# Altium schematic sheet Clock_circuit.SchDoc: FMC_ADC
size 420 x 297 mm; Author: G.Kasprowicz; CompanyName: WUT ISE; DrawnBy: G.Kasprowicz; Organization: WUT ISE; Address1: PW ISE; Address2: Nowowiejska 15/19 00-665 Warsaw; Address3: gkasprow@gmail.com; DocumentNumber: 6; Revision: 2; SheetNumber: 6; SheetTotal: 12; ModifiedBy: -; CheckedDate: -; Title2: Clock distribution; DivGrp: WUT ISE; Designer: G.Kasprowicz; ModifiedDate: -; ProjectName: Sensor Box
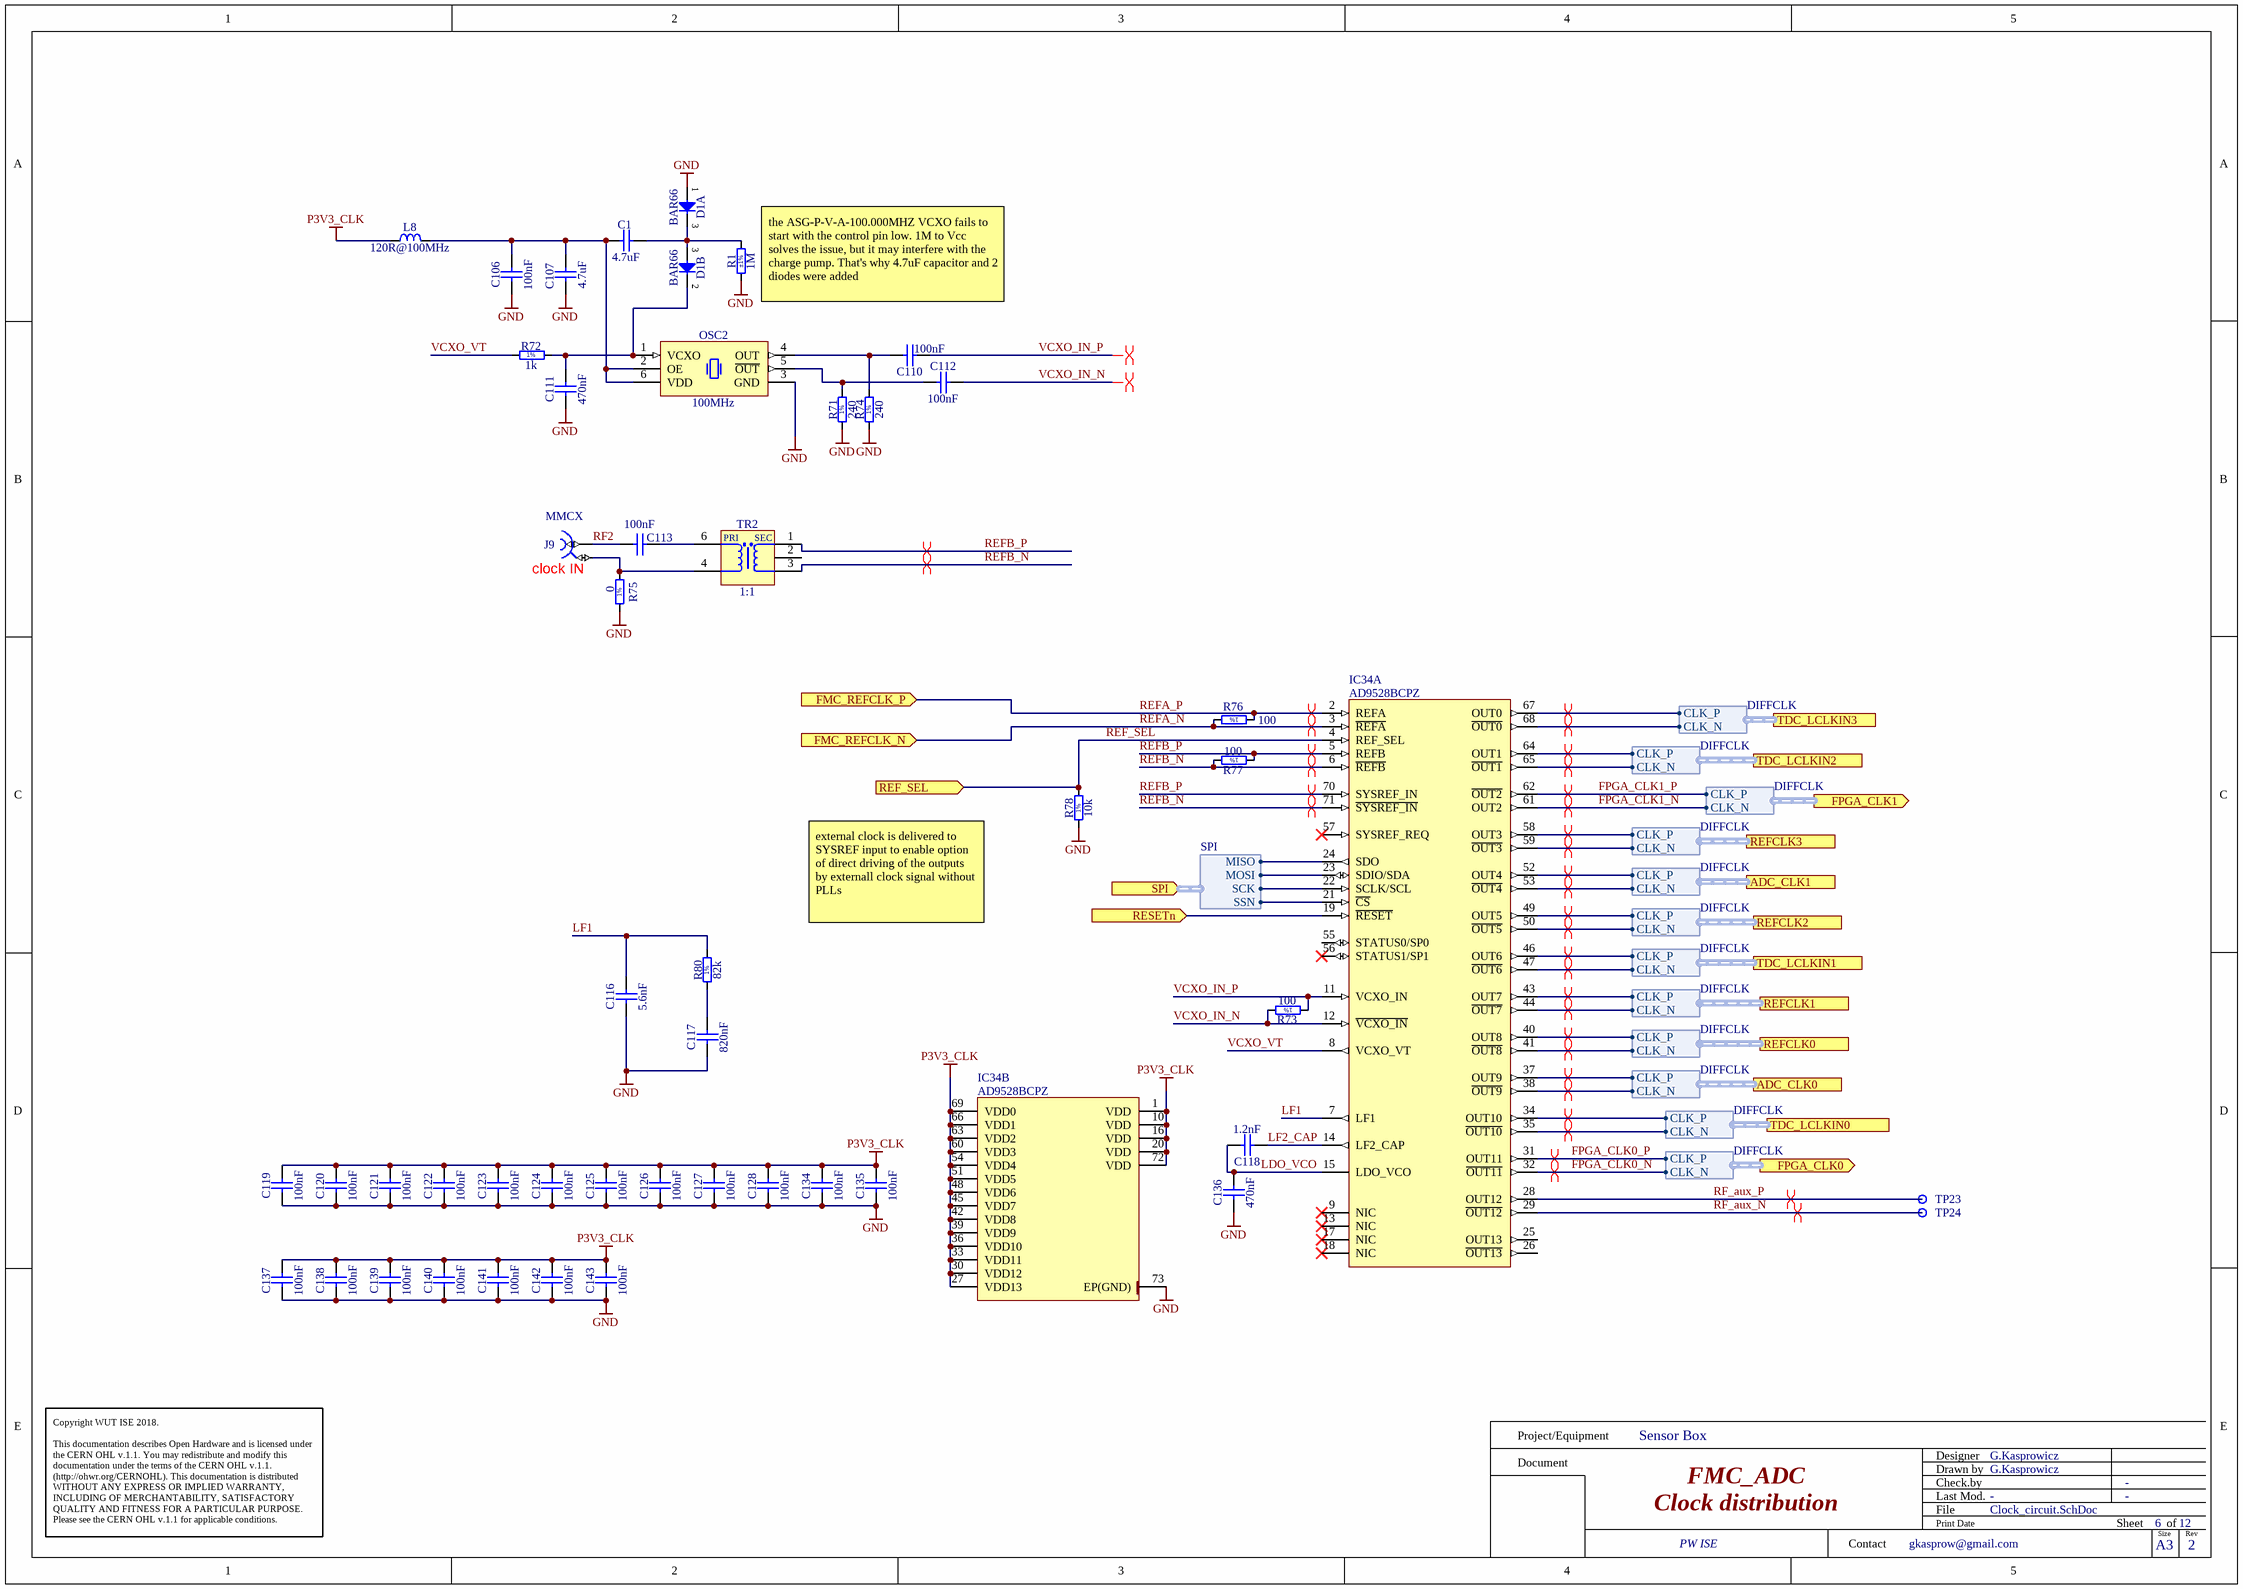
[diagram p0: Clock_circuit.SchDoc]

## Parts
C1  4.7uF  [CAPC1608X87N]
C106  100nF  [CAPC0603X33N]
C107  4.7uF  [CAPC1608X87N]
C110  100nF  [CAPC0603X33N]
C111  470nF  [CAPC1005X55N]
C112  100nF  [CAPC0603X33N]
C113  100nF  [CAPC0603X33N]
C116  5.6nF  [CAPC2012X88N]
C117  820nF  [CAPC3216X130N]
C118  1.2nF  [CAPC1608X80N]
C119  100nF  [CAPC0603X33N]
C120  100nF  [CAPC0603X33N]
C121  100nF  [CAPC0603X33N]
C122  100nF  [CAPC0603X33N]
C123  100nF  [CAPC0603X33N]
C124  100nF  [CAPC0603X33N]
C125  100nF  [CAPC0603X33N]
C126  100nF  [CAPC0603X33N]
C127  100nF  [CAPC0603X33N]
C128  100nF  [CAPC0603X33N]
C134  100nF  [CAPC0603X33N]
C135  100nF  [CAPC0603X33N]
C136  470nF  [CAPC1005X55N]
C137  100nF  [CAPC0603X33N]
C138  100nF  [CAPC0603X33N]
C139  100nF  [CAPC0603X33N]
C140  100nF  [CAPC0603X33N]
C141  100nF  [CAPC0603X33N]
C142  100nF  [CAPC0603X33N]
C143  100nF  [CAPC0603X33N]
D1  BAR66  [SOT95P240X110-3N]  (parts A,B of 2)
IC34  AD9528BCPZ  [QFN50P1000X1000X100-73N-S545]  (parts A,B of 2)
J9  Family: MMCX  [HUBER-SUHNER_85_MMCX-50-0-1/111 OH]  (hidden comment: Coax_1Female_1Shield)
L8  120R@100MHz  [INDC1608X65N]
OSC2  100MHz  [OSCSC254P500X700X190-6N]
R1  1M  Tolerance: ±1%  [RESC1005X40N]
R71  240  [RESC1005X40N]
R72  1k  [RESC1005X40N]
R73  100  [RESC0603X28N]
R74  240  [RESC1005X40N]
R75  0  [RESC1005X40N]
R76  100  [RESC0603X28N]
R77  100  [RESC0603X28N]
R78  10k  [RESC1005X40N]
R80  82k  [RESC1005X40N]
TP23  Test Point  [TPS127]  (value not drawn)
TP24  Test Point  [TPS127]  (value not drawn)
TR2  1:1  [XFMR_MINI-CIRCUITS_AT224-1]

## Ports
ADC_CLK0 (harness DIFFCLK), ADC_CLK1 (harness DIFFCLK), FMC_REFCLK_N (in), FMC_REFCLK_P (in), FPGA_CLK0 (out, harness DIFFCLK), FPGA_CLK1 (out, harness DIFFCLK), REF_SEL (in), REFCLK0 (harness DIFFCLK), REFCLK1 (harness DIFFCLK), REFCLK2 (harness DIFFCLK), REFCLK3 (harness DIFFCLK), RESETn (in), SPI (in, harness SPI), TDC_LCLKIN0 (harness DIFFCLK), TDC_LCLKIN1 (harness DIFFCLK), TDC_LCLKIN2 (harness DIFFCLK), TDC_LCLKIN3 (harness DIFFCLK)

## Harnesses
DIFFCLK: CLK_P, CLK_N
SPI: MISO, MOSI, SCK, SSN

## Nets
GND: C106.1 C107.1 C111.1 C116.1 C117.1 C119.1 C120.1 C121.1 C122.1 C123.1 C124.1 C125.1 C126.1 C127.1 C128.1 C134.1 C135.1 C136.1 C137.1 C138.1 C139.1 C140.1 C141.1 C142.1 C143.1 D1.1(A) IC34.73(EP(GND)) OSC2.3(GND) R1.1 R71.1 R74.1 R75.1 R78.1
P3V3_CLK: C119.2 C120.2 C121.2 C122.2 C123.2 C124.2 C125.2 C126.2 C127.2 C128.2 C134.2 C135.2 C137.2 C138.2 C139.2 C140.2 C141.2 C142.2 C143.2 IC34.1(VDD) IC34.10(VDD) IC34.16(VDD) IC34.20(VDD) IC34.27(VDD13) IC34.30(VDD12) IC34.33(VDD11) IC34.36(VDD10) IC34.39(VDD9) IC34.42(VDD8) IC34.45(VDD7) IC34.48(VDD6) IC34.51(VDD5) IC34.54(VDD4) IC34.60(VDD3) IC34.63(VDD2) IC34.66(VDD1) IC34.69(VDD0) IC34.72(VDD) L8.1
FPGA_CLK0_N: IC34.32(~{OUT11}) ; port FPGA_CLK0.CLK_N
FPGA_CLK0_P: IC34.31(OUT11) ; port FPGA_CLK0.CLK_P
FPGA_CLK1_N: IC34.61(OUT2) ; port FPGA_CLK1.CLK_N
FPGA_CLK1_P: IC34.62(~{OUT2}) ; port FPGA_CLK1.CLK_P
LDO_VCO: C118.2 C136.2 IC34.15(LDO_VCO)
LF1: C116.2 IC34.7(LF1) R80.2
LF2_CAP: C118.1 IC34.14(LF2_CAP)
REF_SEL: IC34.4(REF_SEL) R78.2 ; port REF_SEL
REFA_N: IC34.3(~{REFA}) R76.2 ; port FMC_REFCLK_N
REFA_P: IC34.2(REFA) R76.1 ; port FMC_REFCLK_P
REFB_N: IC34.6(~{REFB}) IC34.71(~{SYSREF_IN}) R77.2 TR2.3(S)
REFB_P: IC34.5(REFB) IC34.70(SYSREF_IN) R77.1 TR2.1(SDOT)
RESETn: IC34.19(~{RESET}) ; port RESETn
RF2: C113.2 J9.1
RF_aux_N: IC34.29(~{OUT12}) TP24.1
RF_aux_P: IC34.28(OUT12) TP23.1
VCXO_IN_N: C112.2 IC34.12(~{VCXO_IN}) R73.2
VCXO_IN_P: C110.1 IC34.11(VCXO_IN) R73.1
VCXO_VT: IC34.8(VCXO_VT) R72.1
NetC1_1: C1.1 C106.2 C107.2 L8.2 OSC2.2(OE) OSC2.6(VDD)
NetC1_2: C1.2 D1.3(COMAC) R1.2
NetC110_2: C110.2 OSC2.4(OUT) R74.2
NetC111_2: C111.2 D1.2(C) OSC2.1(VCXO) R72.2
NetC112_1: C112.1 OSC2.5(~{OUT}) R71.2
NetC113_1: C113.1 TR2.6(PDOT)
NetC117_2: C117.2 R80.1
NetIC34_21: IC34.21(~{CS}) ; port SPI.SSN
NetIC34_22: IC34.22(SCLK/SCL) ; port SPI.SCK
NetIC34_23: IC34.23(SDIO/SDA) ; port SPI.MOSI
NetIC34_24: IC34.24(SDO) ; port SPI.MISO
NetIC34_34: IC34.34(OUT10) ; port TDC_LCLKIN0.CLK_P
NetIC34_35: IC34.35(~{OUT10}) ; port TDC_LCLKIN0.CLK_N
NetIC34_37: IC34.37(OUT9) ; port ADC_CLK0.CLK_P
NetIC34_38: IC34.38(~{OUT9}) ; port ADC_CLK0.CLK_N
NetIC34_40: IC34.40(OUT8) ; port REFCLK0.CLK_P
NetIC34_41: IC34.41(~{OUT8}) ; port REFCLK0.CLK_N
NetIC34_43: IC34.43(OUT7) ; port REFCLK1.CLK_P
NetIC34_44: IC34.44(~{OUT7}) ; port REFCLK1.CLK_N
NetIC34_46: IC34.46(OUT6) ; port TDC_LCLKIN1.CLK_P
NetIC34_47: IC34.47(~{OUT6}) ; port TDC_LCLKIN1.CLK_N
NetIC34_49: IC34.49(OUT5) ; port REFCLK2.CLK_P
NetIC34_50: IC34.50(~{OUT5}) ; port REFCLK2.CLK_N
NetIC34_52: IC34.52(OUT4) ; port ADC_CLK1.CLK_P
NetIC34_53: IC34.53(~{OUT4}) ; port ADC_CLK1.CLK_N
NetIC34_58: IC34.58(OUT3) ; port REFCLK3.CLK_P
NetIC34_59: IC34.59(~{OUT3}) ; port REFCLK3.CLK_N
NetIC34_64: IC34.64(OUT1) ; port TDC_LCLKIN2.CLK_P
NetIC34_65: IC34.65(~{OUT1}) ; port TDC_LCLKIN2.CLK_N
NetIC34_67: IC34.67(OUT0) ; port TDC_LCLKIN3.CLK_P
NetIC34_68: IC34.68(~{OUT0}) ; port TDC_LCLKIN3.CLK_N
NetJ9_2: J9.2 R75.2 TR2.4(P)

Not connected (* = marked no-connect by the designer): IC34 9(NIC)* 13(NIC)* 17(NIC)* 18(NIC)* 25(OUT13) 26(~{OUT13}) 55(STATUS0/SP0) 56(STATUS1/SP1)* 57(SYSREF_REQ)*; TR2 2(NU)

## Layout directives
differential pair: FPGA_CLK0_N, FPGA_CLK0_P, FPGA_CLK1_N, FPGA_CLK1_P, NetIC34_34, NetIC34_35, NetIC34_37, NetIC34_38, NetIC34_40, NetIC34_41, NetIC34_43, NetIC34_44, NetIC34_46, NetIC34_47, NetIC34_49, NetIC34_50, NetIC34_52, NetIC34_53, NetIC34_58, NetIC34_59, NetIC34_64, NetIC34_65, NetIC34_67, NetIC34_68, REFA_N, REFA_P, REFB_N, REFB_P, RF_aux_N, RF_aux_P, VCXO_IN_N, VCXO_IN_P

## Notes on the sheet
- (near R1) the ASG-P-V-A-100.000MHZ VCXO fails to start with the control pin low. 1M to Vcc solves the issue, but it may interfere with the charge pump. That's why 4.7uF capacitor and 2 diodes were added
- (near J9) clock IN
- external clock is delivered to SYSREF input to enable option of direct driving of the outputs by externall clock signal without PLLs
- Project/Equipment
- Document
- Designer
- Drawn by
- Check.by
- Copyright WUT ISE 2018.
  This documentation describes Open Hardware and is licensed under the CERN OHL v.1.1. You may redistribute and modify this documentation under the terms of the CERN OHL v.1.1. (http://ohwr.org/CERNOHL). This documentation is distributed WITHOUT ANY EXPRESS OR IMPLIED WARRANTY, INCLUDING OF MERCHANTABILITY, SATISFACTORY QUALITY AND FITNESS FOR A PARTICULAR PURPOSE. Please see the CERN OHL v.1.1 for applicable conditions.
- Contact
- File
- Last Mod.
- Print Date
- Sheet
- Size
- A3
- of
- Rev
- (in symbol R0201_100R_1%_0.05W_200PPM) 1%
- (in symbol R0402_0R_JUMPER) 1%
- (in symbol R0402_1K_1%_0.0625W_100PPM) 1%
- (in symbol R0402_10K_1%_0.0625W_100PPM) 1%
- (in symbol R0402_82K_1%_0.0625W_100PPM) 1%
- (in symbol R0402_240R_1%_0.0625W_100PPM) 1%
- (in symbol XFMR_MINI-CIRCUITS_TC1-1+) PRI; SEC

## Library data of the parts
C1 C107 = CC0603_4.7UF_6.3V_10%_X5R: Non-polarised capacitor; Part Description: SMD Multilayer Chip Ceramic Capacitor; Manufacturer: GENERIC; Manufacturer1 Part Number: 225520613672; Voltage: 6.3V; TC: X5R; Tolerance: ±10%; Part Number: CC0603_4.7UF_6.3V_10%_X5R; Component Kind: Standard; Component Type: Standard; Pin Count: 2; Value: 4.7uF; Status: Preferred; Manufacturer Part Number: CC0603_4.7uF_6.3V_10%_X5R; Case: 0603; Mounted: Yes; Socket: No; SMD: Yes; Manufacturer1 Example: PHYCOMP; Manufacturer1 ComponentHeight: 0.87mm; HelpURL: \\cern.ch\dfs\Applications\Altium\Datasheets\CC0805_X5R_PHYCOMP_HC.pdf; Author: CERN DEM JLC; CreateDate: 03.12.2007; LatestRevisionDate: 03.12.2007; Sense: No
C106 C110 C112 C119-C128 C134 C135 C137-C143 = CC0201_100NF_6.3V_10%_X5R: Non-polarised capacitor; Part Description: SMD Multilayer Chip Ceramic Capacitor; Manufacturer: GENERIC; Manufacturer1 Part Number: 02016D104KAT2A; Tolerance: ±10%; Voltage: 6.3V; TC: X5R; Value: 100nF; Part Number: CC0201_100NF_6.3V_10%_X5R; Component Kind: Standard; Component Type: Standard; Pin Count: 2; Status: Not Recommended; Manufacturer Part Number: CC0201_100NF_6.3V_10%_X5R; Case: 0201; Mounted: Yes; Socket: No; SMD: Yes; Sense: No; Manufacturer1 Example: AVX; Manufacturer1 ComponentHeight: 0.33mm; HelpURL: \\cern.ch\dfs\Applications\Altium\Datasheets\CC0201_X5R_AVX.pdf; Author: CERN DEM JLC; CreateDate: 03.12.2007; LatestRevisionDate: 03.12.2007
C111 C136 = CC0402_470NF_6.3V_10%_X5R: Non-polarised capacitor; Part Description: SMD Multilayer Chip Ceramic Capacitor; Manufacturer: GENERIC; Manufacturer1 Part Number: GRM155R60J474KE19D; Tolerance: ±10%; Voltage: 6.3V; TC: X5R; Value: 470nF; Part Number: CC0402_470NF_6.3V_10%_X5R; Component Kind: Standard; Component Type: Standard; Pin Count: 2; Status: Preferred; Manufacturer Part Number: CC0402_470NF_6.3V_10%_X5R; Case: 0402; Mounted: Yes; Socket: No; SMD: Yes; Sense: No; Manufacturer1 Example: MURATA; Manufacturer1 ComponentHeight: 0.55mm; HelpURL: \\cern.ch\dfs\Applications\Altium\Datasheets\CC0402_X5R_MURATA_GRM.pdf; Author: CERN DEM JLC; CreateDate: 22.04.2010; LatestRevisionDate: 22.04.2010
C113 = CC0201_100NF_6.3V_10%_X5R: Non-polarised capacitor; Part Description: SMD Multilayer Chip Ceramic Capacitor; Manufacturer: GENERIC; Manufacturer1 Part Number: 02016D104KAT2A; Voltage: 6.3V; TC: X5R; Tolerance: ±10%; Table: Capacitors SMD; Part Number: CC0201_100NF_6.3V_10%_X5R; Component Kind: Standard; Component Type: Standard; Pin Count: 2; Value: 100nF; Status: Not Recommended; Manufacturer Part Number: CC0201_100NF_6.3V_10%_X5R; Case: 0201; Mounted: Yes; Socket: No; SMD: Yes; Manufacturer1 Example: AVX; Manufacturer1 ComponentHeight: 0.33mm; HelpURL: \\cern.ch\dfs\Applications\Altium\Datasheets\CC0201_X5R_AVX.pdf; Author: CERN DEM JLC; CreateDate: 2007-12-03; LatestRevisionDate: 2007-12-03
C116 = CC0805_5.6NF_50V_5%_C0G: Non-polarised capacitor; Part Description: SMD Multilayer Chip Ceramic Capacitor; Manufacturer: GENERIC; Manufacturer1 Part Number: GRM2195C1H562JA01D; Voltage: 50V; TC: C0G/NP0; Tolerance: ±5%; Part Number: CC0805_5.6NF_50V_5%_C0G; Component Kind: Standard; Component Type: Standard; Pin Count: 2; Value: 5.6nF; Status: Preferred; Manufacturer Part Number: CC0805_5.6NF_50V_5%_C0G; Case: 0805; Mounted: Yes; Socket: No; SMD: Yes; Sense: No; Manufacturer1 Example: Murata; Manufacturer1 ComponentHeight: 0.85mm; Author: *
C117 = CC1206_820NF_25V_10%_X7R: Non-polarised capacitor; Part Description: SMD Multilayer Chip Ceramic Capacitor; Manufacturer: GENERIC; Manufacturer1 Part Number: 12063C824KAT2A; Voltage: 25V; TC: X7R; Tolerance: ±10%; Part Number: CC1206_820NF_25V_10%_X7R; Component Kind: Standard; Component Type: Standard; Pin Count: 2; Value: 820nF; Manufacturer Part Number: CC1206_820NF_25V_10%_X7R; Case: 1206; Mounted: Yes; Socket: No; SMD: Yes; Sense: No; Manufacturer1 ComponentHeight: 1.25mm; Manufacturer1 Example: AVX
C118 = CC0603_1.2NF_50V_5%_C0G: Non-polarised capacitor; Part Description: SMD Multilayer Chip Ceramic Capacitor; Manufacturer: GENERIC; Manufacturer1 Part Number: C0603C122J5GACTU; Tolerance: ±5%; Voltage: 50V; TC: C0G/NP0; Value: 1.2nF; Part Number: CC0603_1.2NF_50V_5%_C0G; Component Kind: Standard; Component Type: Standard; Pin Count: 2; Status: Preferred; Manufacturer Part Number: CC0603_1.2NF_50V_5%_C0G; Case: 0603; Mounted: Yes; Socket: No; SMD: Yes; Sense: No; Manufacturer1 Example: KEMET; Manufacturer1 ComponentHeight: 0.8mm; Author: *
D1 = BAR66: Serial Diode; Part Description: Silicon PIN Diode Array (Series Connected); Manufacturer: INFINEON; Voltage: 150V; Power: 250mA; Table: Diodes; Part Number: BAR66; Component Kind: Standard; Component Type: Standard; Device: BAR66; PackageDescription: SOT23 3-Leads, Pitch 0.95mm - Body 1.3x2.9mm, IPC Medium Density; Manufacturer Part Number: BAR66; Pin Count: 3; Case: SOT23; Mounted: Yes; Socket: No; SMD: Yes; ComponentHeight: 1.1mm; HelpURL: \\cern.ch\dfs\Applications\Altium\Datasheets\BAR66.pdf; Author: CERN DEM JLC; CreateDate: 18/1/2010; LatestRevisionDate: 5/10/2010
IC34 = AD9528BCPZ: Clock Generator with 14 LVDS/HSTL Outputs; Manufacturer: ANALOG DEVICES; PressFit: No; Bonding: No; Part Number: AD9528BCPZ; Component Kind: Standard; Component Type: Standard; Device: AD9528BCPZ; PackageDescription: QFN,0.50mm Pitch, Square;72 Pin,10.00mm L X 10.00mm W X 1.00mm H Body (W/Thermal Tab 5.45mm X 5.45mm), IPC Medium Density; Part Description: Clock Generator with 14 LVDS/HSTL Outputs; Manufacturer Part Number: AD9528BCPZ; Pin Count: 73; Case: QFN72; Mounted: Yes; Socket: No; SMD: Yes; Sense: No; ComponentHeight: 1mm; HelpURL: \\cern.ch\dfs\Applications\Altium\Datasheets\AD9528BCPZ.pdf; Author: CERN DEM JLC; CreateDate: 11.10.2016; LatestRevisionDate: 11.10.2016
J9 = HUBER-SUHNER_85_MMCX-50-0-1/111 OH: Part Description: MMCX 50 Ohms Right Angle PCB Jack; Manufacturer: HUBER+SUHNER; Table: Miscellaneous; Part Number: HUBER-SUHNER_85_MMCX-50-0-1/111 OH; Component Kind: Standard; Component Type: Standard; Pin Count: 2; Mounted: Yes; Socket: No; SMD: No; Status: None; Manufacturer Part Number: 85_MMCX-50-0-1/111 OH; ComponentHeight: 9.6mm; HelpURL: \\cern.ch\dfs\Applications\Altium\Datasheets\HUBER-SUHNER_85_MMCX-50-0-1-111 OH.pdf; Author: CERN DEM JLC; CreateDate: 2011-10-04; LatestRevisionDate: 2011-10-04
L8 = IND0603_MURATA_BLM18SG121TN1D: Inductor; Part Description: SMD EMIFIL Suppression Chip Ferrite Bead; Manufacturer: MURATA; Power: 3A; Resistance: 0.025R; Tolerance: ±25%; Part Number: IND0603_MURATA_BLM18SG121TN1D; Component Kind: Standard; Component Type: Standard; Pin Count: 2; Value: 120R@100MHz; Status: None; Manufacturer Part Number: BLM18SG121TN1D; Case: 0603; Mounted: Yes; Socket: No; SMD: Yes; Sense: No; ComponentHeight: 0.65mm; HelpURL: \\cern.ch\dfs\Applications\Altium\Datasheets\IND0603_MURATA_BLM18S.pdf; Author: CERN DEM JLC; CreateDate: 23.07.2014; LatestRevisionDate: 23.07.2014
OSC2 = OSC_100MHz_LVPECL: VCXO 100MHz Oscillator; Part Number: OSC_100MHZ_ABRACON_ASG-P-V-A-100.000MHZ; Part Description: Stability: ± 50ppm, -40°C to +85°C, Programmable - High Performance SMD XO, LVPECL Output, ASG-P Series; Manufacturer: ABRACON; Manufacturer Part Number: ASG-P-V-A-100.000MHZ; PressFit: No; Bonding: No; Component Kind: Standard; Component Type: Standard; PackageDescription: Oscillator, side concave; 2.54mm pitch; 6 pin, 5.00mm L X 7.00mm W X 1.90mm H, IPC Medium Density; Value: 100MHz; Pin Count: 6; Mounted: Yes; Socket: No; SMD: Yes; Sense: No; ComponentHeight: 1.9mm; HelpURL: \\cern.ch\dfs\Applications\Altium\Datasheets\OSC_ABRACON_ASG-D.pdf; Author: GK; CreateDate: 20.04.2016; LatestRevisionDate: 20.04.2016
R1 = R0402_1M_1%_0.0625W_100PPM: Resistor - 1%; Part Description: General Purpose Thick Film Chip Resistor; Manufacturer: GENERIC; Manufacturer1 Part Number: 232270671005L; TC: ±100ppm/°C; PressFit: No; Part Number: R0402_1M_1%_0.0625W_100PPM; Component Kind: Standard; Component Type: Standard; Pin Count: 2; Value: 1M; Status: Not Recommended; Power: 0.0625W; Manufacturer Part Number: R0402_1M_1%_0.0625W_100PPM; Case: 0402; Mounted: Yes; Sense: No; Socket: No; SMD: Yes; Manufacturer1 Example: YAGEO PHYCOMP; Manufacturer1 ComponentHeight: 0.4mm; HelpURL: \\cern.ch\dfs\Applications\Altium\Datasheets\R0402_Phycomp_RC0402.pdf; Author: CERN DEM JLC; CreateDate: 03.12.2007; LatestRevisionDate: 17.10.2012
R71 R74 = R0402_240R_1%_0.0625W_100PPM: Resistor - 1%; Part Description: General Purpose Thick Film Chip Resistor; Manufacturer: GENERIC; Manufacturer1 Part Number: 232270672401L; TC: ±100ppm/°C; PressFit: No; Part Number: R0402_240R_1%_0.0625W_100PPM; Component Kind: Standard; Component Type: Standard; Pin Count: 2; Value: 240; Status: Not Recommended; Power: 0.0625W; Tolerance: ±1%; Manufacturer Part Number: R0402_240R_1%_0.0625W_100PPM; Case: 0402; Mounted: Yes; Sense: No; Socket: No; SMD: Yes; Manufacturer1 Example: YAGEO PHYCOMP; Manufacturer1 ComponentHeight: 0.4mm; HelpURL: \\cern.ch\dfs\Applications\Altium\Datasheets\R0402_Phycomp_RC0402.pdf; Author: CERN DEM JLC; CreateDate: 03.12.2007; LatestRevisionDate: 17.10.2012
R72 = R0402_1K_1%_0.0625W_100PPM: Resistor - 1%; Part Description: General Purpose Thick Film Chip Resistor; Manufacturer: GENERIC; Manufacturer1 Part Number: 232270671002L; TC: ±100ppm/°C; Tolerance: ±1%; Value: 1k; Power: 0.0625W; Part Number: R0402_1K_1%_0.0625W_100PPM; Component Kind: Standard; Component Type: Standard; Pin Count: 2; Status: Not recommended; Manufacturer Part Number: R0402_1K_1%_0.0625W_100PPM; Case: 0402; Mounted: Yes; Sense: No; Socket: No; SMD: Yes; Manufacturer1 Example: YAGEO PHYCOMP; Manufacturer1 ComponentHeight: 0.4mm; HelpURL: \\cern.ch\dfs\Applications\Altium\Datasheets\R0402_Phycomp_RC0402.pdf; Author: CERN DEM JLC; CreateDate: 03.12.2007; LatestRevisionDate: 17.10.2012
R73 R76 R77 = R0201_100R_1%_0.05W_200PPM: Resistor - 1%; Part Description: Thick Film Chip Resistor; Manufacturer: GENERIC; Manufacturer1 Part Number: CRCW0201100RFNED; Power: 0.05W; TC: ±200ppm/°C; PressFit: No; Part Number: R0201_100R_1%_0.05W_200PPM; Component Kind: Standard; Component Type: Standard; Pin Count: 2; Value: 100; Status: Not Recommended; Tolerance: ±1%; Manufacturer Part Number: R0201_100R_1%_0.05W_200PPM; Case: 0201; Mounted: Yes; Socket: No; SMD: Yes; Manufacturer1 Example: VISHAY; Manufacturer1 ComponentHeight: 0.27mm; HelpURL: \\cern.ch\dfs\Applications\Altium\Datasheets\R0201_VISHAY_CRCW0201 e3.pdf; Author: CERN DEM JLC; CreateDate: 13.11.2014; LatestRevisionDate: 13.11.2014; Sense: No
R75 = R0402_0R_JUMPER: Resistor - 1%; Part Description: 1A (0.05R Max DC Resistance) Zero Ohm Jumper; Manufacturer: GENERIC; Manufacturer1 Part Number: 232270591001L; Table: Resistors SMD; Part Number: R0402_0R_JUMPER; Component Kind: Standard; Component Type: Standard; Pin Count: 2; Value: 0; Status: Not recommended; Manufacturer Part Number: R0402_0R_JUMPER; Case: 0402; Mounted: Yes; Socket: No; SMD: Yes; Manufacturer1 Example: YAGEO PHYCOMP; Manufacturer1 ComponentHeight: 0.4mm; HelpURL: \\cern.ch\dfs\Applications\Altium\Datasheets\R0402_Phycomp_RC0402.pdf; Author: CERN DEM JLC; CreateDate: 3/12/2007; LatestRevisionDate: 17/10/2012
R78 = R0402_10K_1%_0.0625W_100PPM: Resistor - 1%; Part Description: General Purpose Thick Film Chip Resistor; Manufacturer: GENERIC; Manufacturer1 Part Number: 232270671003L; TC: ±100ppm/°C; Table: Resistors SMD; Part Number: R0402_10K_1%_0.0625W_100PPM; Component Kind: Standard; Component Type: Standard; Pin Count: 2; Value: 10k; Status: Not recommended; Power: 0.0625W; Tolerance: ±1%; Manufacturer Part Number: R0402_10K_1%_0.0625W_100PPM; Case: 0402; Mounted: Yes; Socket: No; SMD: Yes; Manufacturer1 Example: YAGEO PHYCOMP; Manufacturer1 ComponentHeight: 0.4mm; HelpURL: \\cern.ch\dfs\Applications\Altium\Datasheets\R0402_Phycomp_RC0402.pdf; Author: CERN DEM JLC; CreateDate: 3/12/2007; LatestRevisionDate: 17/10/2012
R80 = R0402_82K_1%_0.0625W_100PPM: Resistor - 1%; Part Description: General Purpose Thick Film Chip Resistor; Manufacturer: GENERIC; Manufacturer1 Part Number: 232270678203L; TC: ±100ppm/°C; Value: 82k; Tolerance: ±1%; Power: 0.0625W; Part Number: R0402_82K_1%_0.0625W_100PPM; Component Kind: Standard; Component Type: Standard; Pin Count: 2; Status: Not recommended; Manufacturer Part Number: R0402_82K_1%_0.0625W_100PPM; Case: 0402; Mounted: Yes; Sense: No; Socket: No; SMD: Yes; Manufacturer1 Example: YAGEO PHYCOMP; Manufacturer1 ComponentHeight: 0.4mm; HelpURL: \\cern.ch\dfs\Applications\Altium\Datasheets\R0402_Phycomp_RC0402.pdf; Author: CERN DEM JLC; CreateDate: 03.12.2007; LatestRevisionDate: 17.10.2012
TP23 TP24 = SMD_PAD_1.27X1.27MM: Part Description: 1.27mm x 1.27mm PCB Copper Area (SMD Test Point); Mounted: No; Part Number: SMD_PAD_1.27X1.27MM; Component Kind: Standard (No BOM); Component Type: Standard (No BOM); Pin Count: 1; Family: Test Point; Socket: No; SMD: Yes; Sense: No; Status: None; ComponentHeight: 0mm; HelpURL: Undefined; Author: CERN DEM JLC; CreateDate: 12.01.2008; LatestRevisionDate: 12.01.2008; PackageDescription: 1.27mm x 1.27mm PCB Copper Area (SMD Test Point)
TR2 = XFMR_MINI-CIRCUITS_TC1-1+: 50 Ohm  0.4 To 500MHz RF Transformers; Part Number: XFMR_MINI-CIRCUITS_TC1-1T+; Part Description: 50 Ohms 1.5 to 500 MHz RF Transformer; Manufacturer Part Number: TC1-1T+; Component Kind: Standard; Component Type: Standard; Pin Count: 5; Value: 1:1; Status: None; Manufacturer: MINI-CIRCUITS; Mounted: Yes; Socket: No; SMD: Yes; ComponentHeight: 4.06mm; HelpURL: \\cern.ch\dfs\Applications\Altium\Datasheets\XFMR_MINI-CIRCUITS_TC1-1+.pdf; Author: CERN DEM JLC; CreateDate: 2010-02-08; LatestRevisionDate: 2010-04-27; Table: Transformers